# EAGLE design PIC-Sensor-101 (EAGLE 5.01)
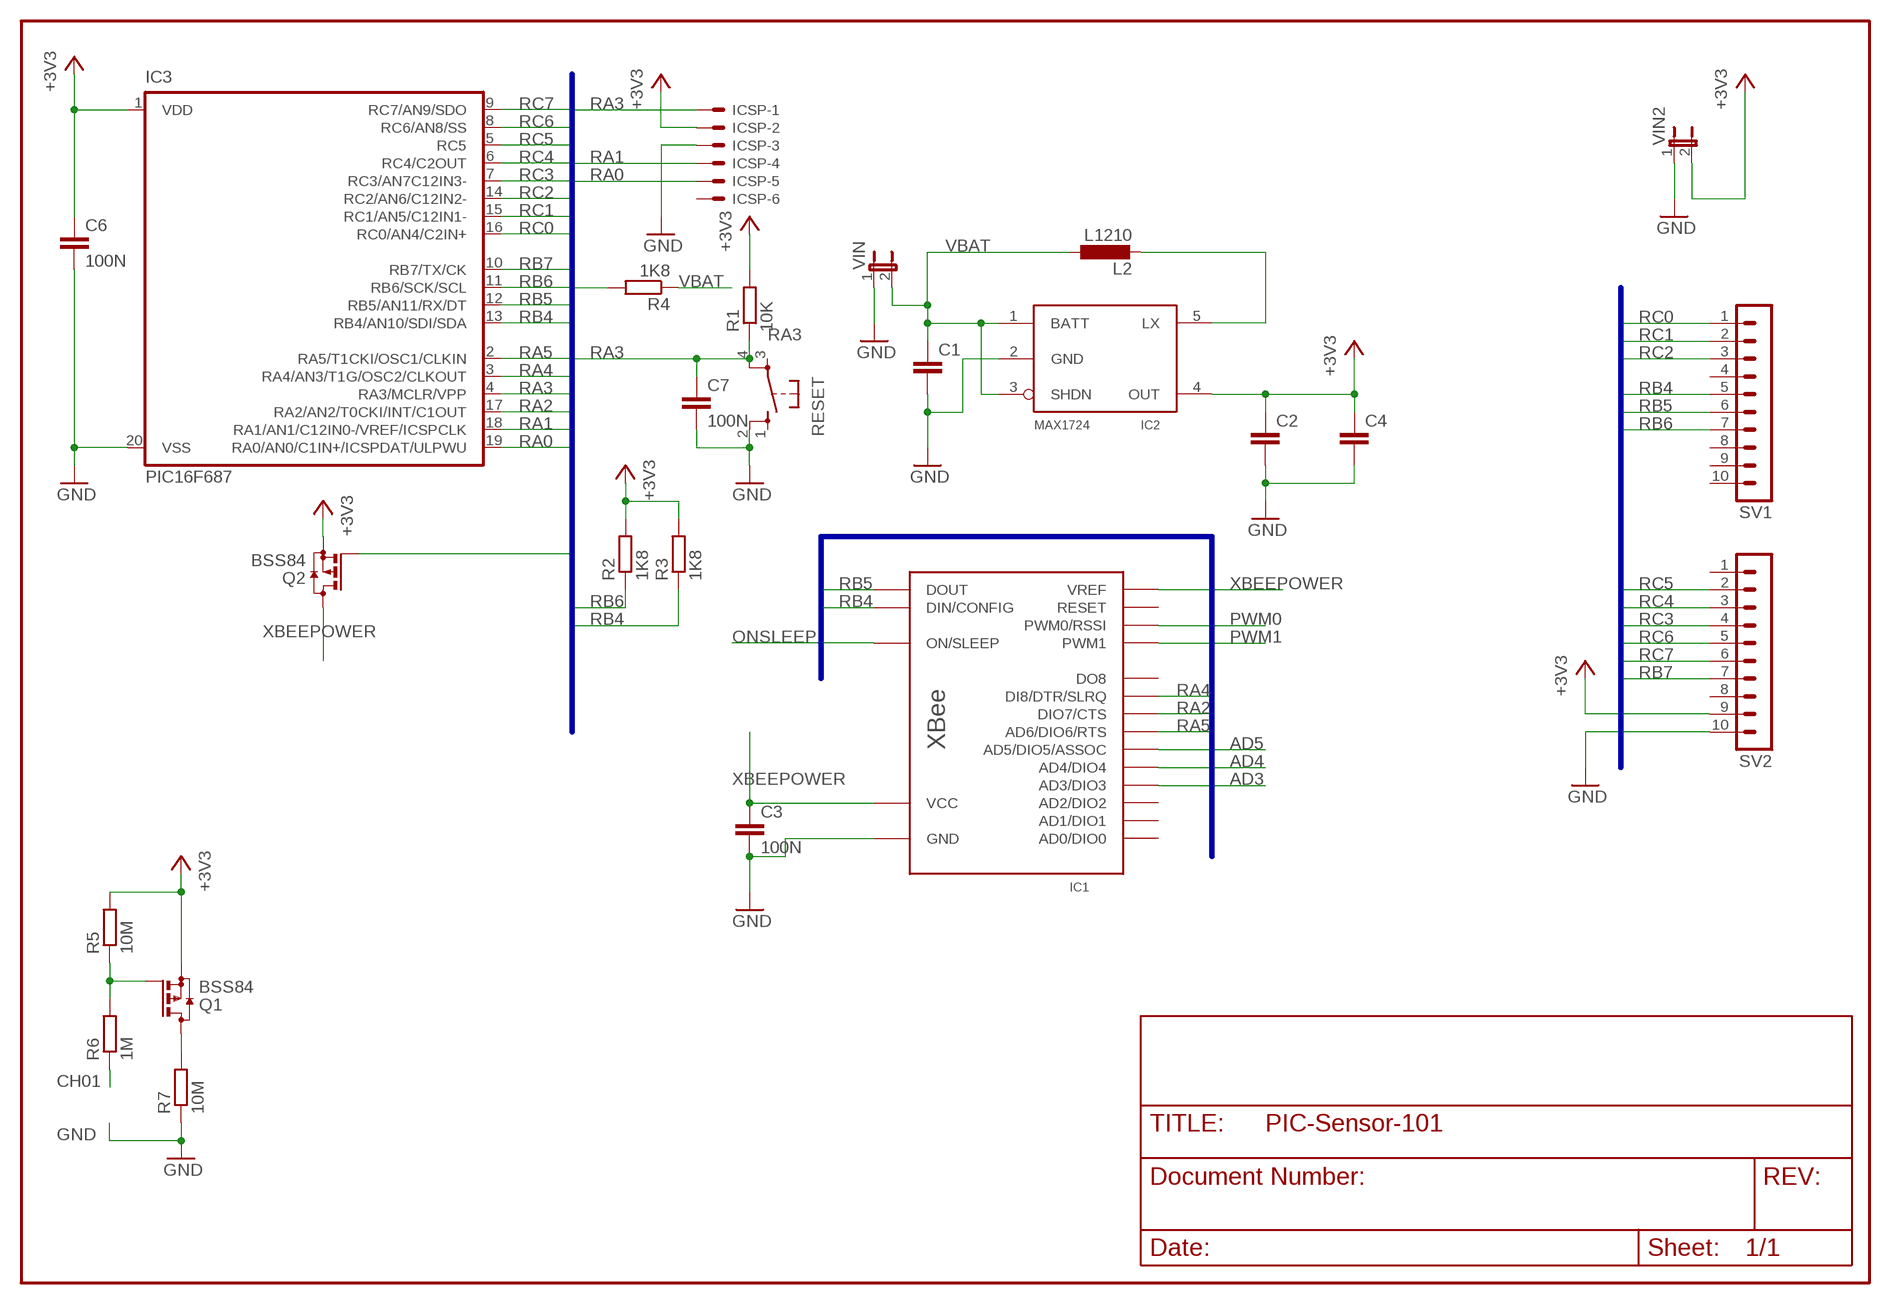
[diagram p0: schematic, sheet 1]

## Parts
C1  C-EUC0805  [C0805]
C2  C-EUC0805  [C0805]
C3  100N  C-EUC0805  [C0805]
C4  C-EUC0805  [C0805]
C6  100N  C-EUC0805  [C0805]
C7  100N  C-EUC0805  [C0805]
IC1  XBEE  [XBEE]
IC2  MAX1724  [SOT23-5L]
IC3  PIC16F687  [SSOP20]
ICSP  53047-06  [53047-06]
L2  L1210  [C1210]
Q1  BSS84  [SOT23]
Q2  BSS84  [SOT23]
R1  10K  R-EU_M0805  [M0805]
R2  1K8  R-EU_M0805  [M0805]
R3  1K8  R-EU_M0805  [M0805]
R4  1K8  R-EU_M0805  [M0805]
R5  10M  R-EU_M0805  [M0805]
R6  1M  R-EU_M0805  [M0805]
R7  10M  R-EU_M0805  [M0805]
RESET  10XX  [B3F-10XX]
SV1  MA10-1  [MA10-1]
SV2  MA10-1  [MA10-1]
VIN  JP1E  [JP1]
VIN2  JP1E  [JP1]

## Nets
+3V3: C2.1 C4.1 C6.1 IC2.4(OUT) IC3.1(VDD) ICSP.2 Q1.2(S) Q2.2(S) R1.2 R2.2 R3.2 R5.2 SV2.9 VIN2.2
AD3: IC1.17(AD3/DIO3)
AD4: IC1.11(AD4/DIO4)
AD5: IC1.15(AD5/DIO5/ASSOC)
CH01: R6.1
GND: C1.2 C2.2 C3.2 C4.2 C6.2 C7.2 IC1.10(GND) IC2.2(GND) IC3.20(VSS) ICSP.3 R7.1 RESET.2 SV2.10 VIN2.1 VIN.1
N$1: Q1.1(G) R5.1 R6.2
N$2: IC2.5(LX) L2.2
N$3: Q1.3(D) R7.2
ONSLEEP: IC1.13(ON/SLEEP)
PWM0: IC1.6(PWM0/RSSI)
PWM1: IC1.7(PWM1)
RA0: IC3.19(RA0/AN0/C1IN+/ICSPDAT/ULPWU) ICSP.5
RA1: IC3.18(RA1/AN1/C12IN0-/VREF/ICSPCLK) ICSP.4
RA2: IC1.12(DIO7/CTS) IC3.17(RA2/AN2/T0CKI/INT/C1OUT)
RA3: C7.1 IC3.4(RA3/MCLR/VPP) ICSP.1 R1.1 RESET.4
RA4: IC1.9(DI8/DTR/SLRQ) IC3.3(RA4/AN3/T1G/OSC2/CLKOUT)
RA5: IC1.16(AD6/DIO6/RTS) IC3.2(RA5/T1CKI/OSC1/CLKIN)
RB4: IC1.3(DIN/CONFIG) IC3.13(RB4/AN10/SDI/SDA) R3.1 SV1.5
RB5: IC1.2(DOUT) IC3.12(RB5/AN11/RX/DT) SV1.6
RB6: IC3.11(RB6/SCK/SCL) R2.1 SV1.7
RB7: IC3.10(RB7/TX/CK) SV2.7
RC0: IC3.16(RC0/AN4/C2IN+) SV1.1
RC1: IC3.15(RC1/AN5/C12IN1-) SV1.2
RC2: IC3.14(RC2/AN6/C12IN2-) SV1.3
RC3: IC3.7(RC3/AN7C12IN3-) SV2.4
RC4: IC3.6(RC4/C2OUT) SV2.3
RC5: IC3.5(RC5) Q2.1(G) SV2.2
RC6: IC3.8(RC6/AN8/SS) SV2.5
RC7: IC3.9(RC7/AN9/SDO) R4.2 SV2.6
VBAT: C1.1 IC2.1(BATT) IC2.3(SHDN) L2.1 R4.1 VIN.2
XBEEPOWER: C3.1 IC1.1(VCC) IC1.14(VREF) Q2.3(D)
Unconnected: IC1.4(DO8) IC1.5(RESET) IC1.18(AD2/DIO2) IC1.19(AD1/DIO1) IC1.20(AD0/DIO0) ICSP.6 RESET.1 RESET.3 SV1.4 SV1.8 SV1.9 SV1.10 SV2.1 SV2.8

## Buses
RA[0..5],RB[4..7],RC[0..7]

## Library data of the parts
C1-C4 C6 C7 = turbod3:C-EU: CAPACITOR, European symbol
IC1 = turbod3:XBEE
IC2 = turbod3:MAX1724
IC3 = microchip-5:PIC16F687*: MICROCONTROLLER PIC16F687 18 I/O One 16-bit timer One 8-bit timer Two comparators Precision internal oscillator-software selectable 8 MHz - 32 KHz SSP w/ I2C Compatible Address mask option EUSART LIN 2.0 Compatible 12 A/D Channels ULPW Enhanced Low Power Timer 1 Timer 1 Gate Synch Latch 2k Program Flash memory 128 bytes SRAM 256 bytes EEPROM
ICSP = con-molex:53?-06: CONNECTOR wire to board 1.25 mm (.049 inch) pitch header
L2 = turbod3:L
Q1 Q2 = transistor-small-signal:BSS84: P-CHANNEL MOS FET
R1-R7 = turbod3:R-EU_: RESISTOR, European symbol
RESET = KEY_B:10XX
SV1 SV2 = con-lstb:MA10-1: PIN HEADER
VIN VIN2 = jumper:JP1E: JUMPER

## Net classes
0 default: width 0.305 mm

## Board
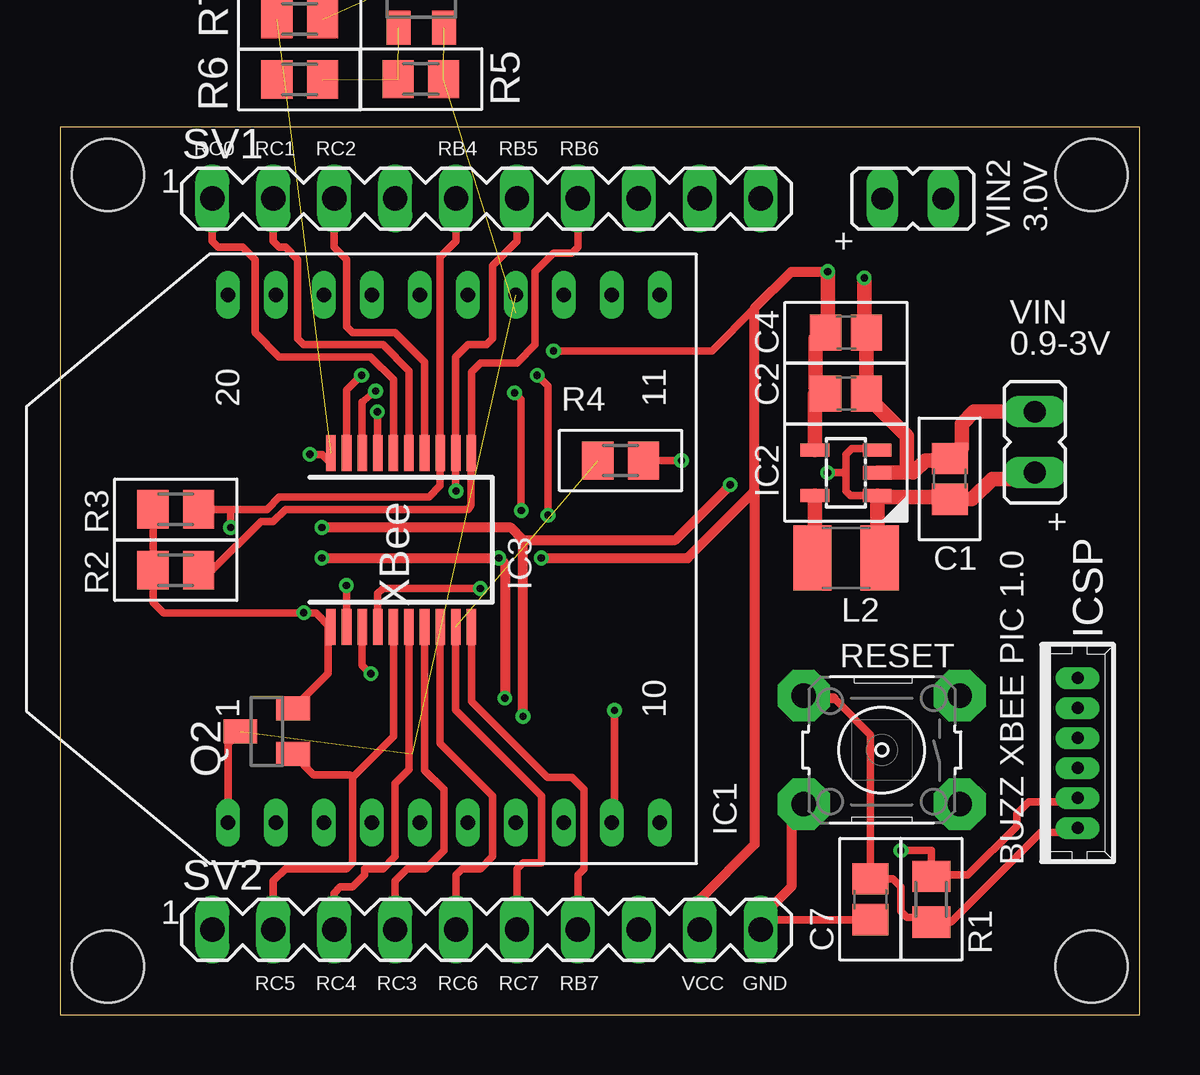
[diagram p1: board, top side]
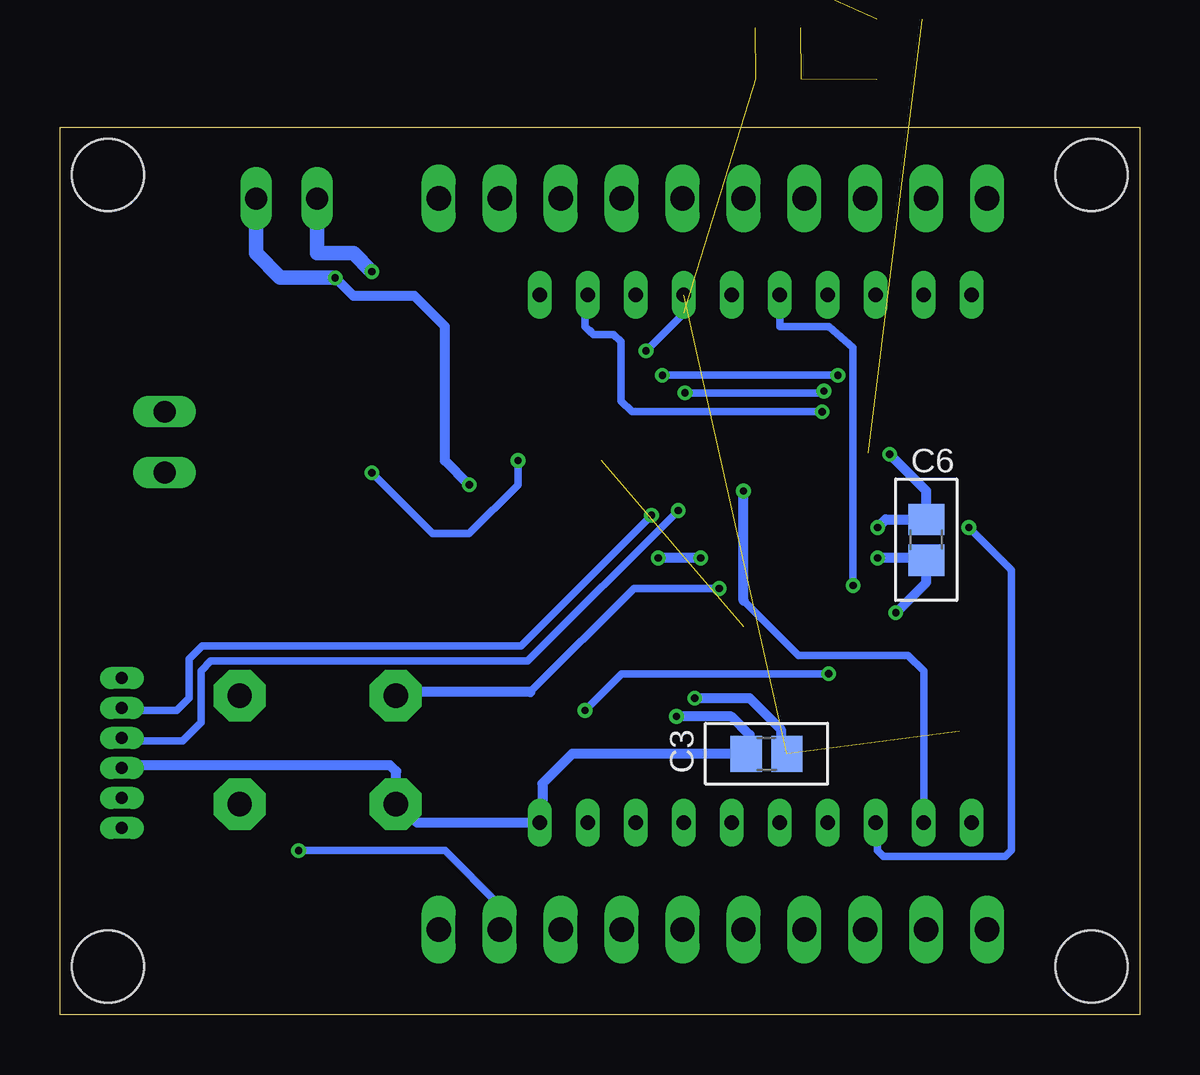
[diagram p2: board, bottom side, seen from below]

Size 45 x 37 mm. Coordinates in mm from the lower left corner, seen from the top.
Outline: 0,0 45,0 45,37 0,37 0,0
Copper layers (1*16): Top 0.035mm / dielectric 1.5mm / Bottom 0.035mm
Design rules "PCB-POOL": minimum track width 6mil, minimum drill 12mil, track to track 6mil, track to pad 6mil, pad to pad 6mil, via to via 6mil, smd to smd 6mil, copper to edge 20mil, drill to drill 8mil, minimum pad ring 8mil, minimum via ring 6mil, stop-mask expansion 3mil, vias tented up to drill 0mil, thermal gap 8mil
Holes 3 mm at 2,35 2,2 43,35 43,2

### Footprints (pad centres in the part's own frame; a part is rotated, then mirrored left to right if it is on the bottom)
C0805 = smd 1.3 x 1.5: 1 -0.85,0; 2 0.85,0
XBEE = drill 0.6 long: 1 -11,17; 2 -11,15; 3 -11,13; 4 -11,11; 5 -11,9; 6 -11,7; 7 -11,5; 8 -11,3; 9 -11,1; 10 -11,-1; 11 11,-1; 12 11,1; 13 11,3; 14 11,5; 15 11,7; 16 11,9; 17 11,11; 18 11,13; 19 11,15; 20 11,17
SOT23-5L = smd 0.55 x 1.2: 1 -0.95,-1.3; 2 0,-1.3; 3 0.95,-1.3; 4 0.95,1.3; 5 -0.95,1.3
SSOP20 = smd 0.4 x 1.5: 1 -2.925,-3.625; 2 -2.275,-3.625; 3 -1.625,-3.625; 4 -0.975,-3.625; 5 -0.325,-3.625; 6 0.325,-3.625; 7 0.975,-3.625; 8 1.625,-3.625; 9 2.275,-3.625; 10 2.925,-3.625; 11 2.925,3.625; 12 2.275,3.625; 13 1.625,3.625; 14 0.975,3.625; 15 0.325,3.625; 16 -0.325,3.625; 17 -0.975,3.625; 18 -1.625,3.625; 19 -2.275,3.625; 20 -2.925,3.625
53047-06 = drill 0.5 pad 0.698 long: 1 3.125,0; 2 1.875,0; 3 0.625,0; 4 -0.625,0; 5 -1.875,0; 6 -3.125,0
C1210 = smd 1.6 x 2.7: 1 -1.4,0; 2 1.4,0
SOT23 = smd 1 x 1.4: 1 -0.95,-1.1; 2 0.95,-1.1; 3 0,1.1
M0805 = smd 1.3 x 1.6: 1 -0.95,0; 2 0.95,0
B3F-10XX = drill 1.016 pad 2.159 octagon: 1 -3.379,2.312; 2 3.123,2.312; 3 -3.379,-2.209; 4 3.123,-2.209
MA10-1 = drill 1.016 long: 1 -11.43,0; 2 -8.89,0; 3 -6.35,0; 4 -3.81,0; 5 -1.27,0; 6 1.27,0; 7 3.81,0; 8 6.35,0; 9 8.89,0; 10 11.43,0
JP1 = drill 0.914 long: 1 0,-1.27; 2 0,1.27

### Placement (x,y rotation side)
C1  37.08,22.34 90 top
C2  32.77,25.89 0 top
C3  15.54,10.87 180 bottom
C4  32.77,28.43 0 top
C6  8.89,19.8 90 bottom
C7  33.78,4.81 270 top
IC1  24,19 90 top
IC2  32.77,22.59 90 top
IC3  14.22,19.8 0 top
ICSP  42.42,10.91 270 top
L2  32.77,19.03 180 top
Q1  15.06,42.24 0 top  (outside the outline)
Q2  8.62,11.81 90 top
R1  36.32,4.81 90 top
R2  4.83,18.53 180 top
R3  4.83,21.07 180 top
R4  23.37,23.1 180 top
R5  15.04,39 0 top
R6  9.99,38.98 0 top
R7  9.99,41.5 0 top  (outside the outline)
RESET  34.13,11.08 180 top
SV1  17.78,34.02 0 top
SV2  17.78,3.54 0 top
VIN  40.64,23.86 180 top
VIN2  35.56,34.02 90 top

### Tracks (layer width: path | path; a pad name or v marks a point on that pad's centre or on a via)
+3V3  (via drill 0.3)  (2 unrouted)
  Top 0.305: 3.88,18.34 R2.2 | 3.88,18.34 R3.2 | 3.88,18.34 3.81,18.27 | 3.88,18.34 3.88,17.19 4.32,16.75 v10.16,16.75 10.67,16.75 11.24,16.17 IC3.1 11.21,16.26 11.18,16.26 11.18,14.22 Q2.2 | ICSP.2 42.42,9.13 42.16,8.87 40.39,8.87 39.88,8.37 39.88,7.86 37.85,5.83 36.07,5.83 36.13,5.76 R1.2 36.32,6.84 v35.05,6.84 | v20.57,27.67 27.18,27.67 28.96,29.45
  Top 0.406: C2.1 31.92,25.81 31.47,25.35 | C2.1 31.5,25.89 31.47,25.86 | C2.1 31.75,25.89 31.5,26.15 | C4.1 31.75,28.43 31.5,28.18 | v32,30.97 30.48,30.97 28.96,29.45 28.96,21.83 | 28.96,21.83 28.96,7.1 26.67,4.81 SV2.9 | v18.54,13.19 18.54,18.78 v18.29,19.03 v10.92,19.03 | v20.07,19.03 26.16,19.03 28.96,21.83
  Top 0.61: 31.47,25.86 IC2.4 | 31.5,28.18 31.5,26.15 | C4.1 31.92,28.6 32,28.69 v32,30.97
  Bottom 0.305: 14.73,10.94 14.73,10.91 14.7,10.87 | v20.57,27.67 19,29.24 | v35.05,6.84 28.96,6.84 26.67,4.56
  Bottom 0.406: 14.73,10.94 14.95,10.94 14.95,11.88 16.26,13.19 v18.54,13.19 | 8.89,18.78 8.89,18.02 v10.16,16.75 | 8.89,18.78 C6.1 | v10.92,19.03 9.14,19.03 8.89,18.78 | v18.29,19.03 v20.07,19.03 | SV2.9 26.67,4.56
  Bottom 0.61: v32,30.97 32.77,31.73 34.29,31.73 VIN2.2 34.04,34.27
GND  (via drill 0.3)  (1 unrouted)
  Top 0.305: IC3.20 11.3,23.22 11.18,23.1 10.92,23.35 v10.41,23.35 | 29.21,4.05 29.21,3.79 | 29.21,3.79 SV2.10 | C7.2 29.38,3.96 29.21,3.79
  Top 0.406: IC2.2 34.04,22.59 | 33.62,25.54 C2.2 33.58,25.84 33.53,25.89 | C1.2 37.08,23.1 37.59,23.61 | 35.31,22.59 35.56,22.59 | 33.53,28.43 33.62,28.34 | v10.92,20.3 18.8,20.3 19.3,19.8 | v19.3,12.43 19.3,19.8 | 19.3,19.8 25.65,19.8 v27.94,22.08 | RESET.2 31.01,8.86 30.99,8.87 30.48,8.37 30.48,5.32 29.21,4.05
  Top 0.61: 37.08,23.1 36.07,23.1 35.56,22.59 | IC2.2 35.31,22.59 35.31,24.11 33.58,25.84 | 33.62,28.34 C2.2 | C4.2 33.53,28.43 v33.53,30.72 | 37.59,23.61 37.59,24.62 38.1,25.13 VIN.1 40.89,24.88
  Bottom 0.406: v33.53,30.72 32.77,29.96 30.23,29.96 28.96,28.69 28.96,23.1 v27.94,22.08 | ICSP.3 42.42,10.14 42.16,10.4 31.24,10.4 30.99,10.14 30.99,8.87 | v10.41,23.35 8.89,21.83 C6.2 10.58,20.65 v10.92,20.3 | v19.3,12.43 17.02,12.43 16.26,11.67 16.26,11.16 16.51,10.91 16.48,10.87 C3.2 23.66,10.87 24.89,9.64 24.89,7.86 25,7.97 IC1.10 30.11,8 30.99,8.87 | 30.99,8.87 31.01,8.86 RESET.2
  Bottom 0.61: v33.53,30.72 35.81,30.72 36.83,31.73 VIN2.1 36.83,34.27
N$1  (2 unrouted)
N$2
  Top 0.406: L2.2 31.37,18.65 31.5,18.78 31.47,18.81
  Top 0.61: 31.47,18.81 IC2.5
N$3  (1 unrouted)
RA0  (via drill 0.3)
  Top 0.305: IC3.19 11.95,26.03 v12.57,26.65 | v20.34,20.81 20.34,26.2 v19.89,26.65
  Bottom 0.305: ICSP.5 42.58,12.78 42.67,12.68 40.13,12.68 39.62,13.19 39.62,14.82 39.06,15.38 25.78,15.38 v20.34,20.81 | v12.57,26.65 12.57,26.76 12.68,26.65 v19.89,26.65
RA1  (via drill 0.3)
  Top 0.305: IC3.18 12.6,25.54 v13.16,25.99 | v19.23,21.02 19.23,25.64 v18.95,25.92
  Bottom 0.305: 42.53,11.53 42.67,11.67 | 42.53,11.53 ICSP.4 | 42.53,11.53 42.42,11.41 39.88,11.41 39.12,12.18 39.12,14.34 38.71,14.74 25.5,14.74 v19.23,21.02 | v13.16,25.99 13.16,26.02 13.18,26.04 13.31,25.92 v18.95,25.92
RA2  (via drill 0.3)
  Top 0.305: IC3.17 13.25,25.09 v13.23,25.13
  Bottom 0.305: 22.92,28.5 23.11,28.69 23.11,30.08 23.03,30 IC1.12 | 22.92,28.5 22.86,28.43 | v13.23,25.13 21.16,25.13 21.61,25.59 21.61,28.05 21.92,28.36 22.76,28.36 22.91,28.51 22.92,28.5
RA3  (via drill 0.3)
  Top 0.305: IC3.4 13.25,17.55 13.46,17.76 v17.53,17.76 | ICSP.1 42.42,7.6 40.89,7.6 37.15,3.86 R1.1 36.39,3.86 36.58,4.05 35.31,4.05 35.05,4.3 35.05,5.32 34.71,5.66 C7.1 33.78,5.57 | 32.26,13.19 33.78,11.67 33.78,5.57 | 33.78,5.57 33.53,5.32
  Top 0.406: RESET.4 31.01,13.21 30.99,13.19 32.26,13.19
  Bottom 0.305: v17.53,17.76 21.08,17.76 25.4,13.45
  Bottom 0.406: RESET.4 31.01,13.21 30.99,13.19 30.73,13.45 25.4,13.45
RA4  (via drill 0.3)
  Top 0.305: IC3.3 12.6,14.56 v12.95,14.21 | IC1.9 22.97,8 22.86,8.11 23.11,8.37 v23.11,12.68
  Bottom 0.305: v12.95,14.21 21.59,14.21 v23.11,12.68
RA5  (via drill 0.3)
  Top 0.305: IC3.2 11.95,18.03 v11.94,17.89
  Bottom 0.305: v11.94,17.89 11.94,27.8 12.95,28.69 14.99,28.69 14.99,30.21 15,30.2 IC1.16
RB4  (via drill 0.3)
  Top 0.305: 8.64,21.07 R3.1 | 8.64,21.07 9.14,21.57 15.39,21.57 15.85,22.06 15.85,23.33 15.82,23.42 IC3.13 15.85,31.58 16.51,32.24 SV1.5 | 8.64,21.07 7.11,21.07 v7.11,20.3
  Bottom 0.305: v7.11,20.3 5.33,18.53 5.33,6.84 5.59,6.59 10.67,6.59 10.92,6.84 10.92,8.08 | 10.92,8.08 10.92,8.11 | 10.92,8.08 IC1.3
RB5  (via drill 0.3)
  Top 0.305: v16.51,21.83 16.5,21.84 IC3.12 16.5,27.41 17.02,27.92 17.78,27.92 18.03,28.18 18.03,31.23 19.05,32.24 SV1.6
  Bottom 0.305: 16.51,17.26 14.22,14.97 9.65,14.97 9,14.32 IC1.2
  Bottom 0.406: 16.51,17.26 v16.51,21.83
RB6
  Top 0.305: R2.1 6.35,18.53 8.38,20.56 8.89,20.56 9.4,21.07 17.02,21.07 17.14,21.24 17.14,23.38 17.2,23.42 IC3.11 17.15,26.79 17.53,27.16 19.05,27.16 19.81,27.92 19.81,30.97 20.57,31.73 21.34,31.73 21.59,31.99 21.59,33.77 21.34,34.02 SV1.7
RB7
  Top 0.305: IC3.10 17.15,13.06 20.32,9.89 21.34,9.89 21.84,9.38 21.84,6.08 21.59,5.83 SV2.7
RC0
  Top 0.305: IC3.16 13.9,26.47 12.95,27.42 9.14,27.42 8.13,28.43 8.13,31.48 7.62,31.99 6.6,31.99 6.35,32.24 SV1.1
RC1
  Top 0.305: IC3.15 14.55,26.84 13.46,27.92 10.16,27.92 9.91,28.18 9.91,31.48 9.4,31.99 9.14,31.99 8.89,32.24 8.89,33.77 9.14,34.02 SV1.2
RC2
  Top 0.305: IC3.14 15.2,27.2 13.97,28.43 12.19,28.43 11.94,28.69 11.94,31.48 11.43,31.99 SV1.3
RC3
  Top 0.305: IC3.7 15.2,10.19 16,9.38 16,6.84 15.24,6.08 14.48,6.08 13.97,5.57 SV2.4 13.97,3.29
RC4
  Top 0.305: IC3.6 14.55,10.21 13.97,9.64 13.97,6.59 13.46,6.08 12.7,6.08 12.7,5.83 12.19,5.32 11.68,5.32 11.43,5.06 SV2.3
RC5
  Top 0.305: IC3.5 13.9,11.6 12.19,9.89 | 12.19,9.89 12.19,6.33 11.94,6.08 9.4,6.08 8.89,5.57 SV2.2 8.89,3.29 | 12.19,9.89 12.08,10 10.58,10 Q2.1
RC6
  Top 0.305: IC3.8 15.85,11.31 18.03,9.13 18.03,6.59 17.53,6.08 16.76,6.08 16.51,5.83 SV2.5
RC7  (1 unrouted)
  Top 0.305: IC3.9 16.5,12.7 20.07,9.13 20.07,6.33 19.3,6.33 19.05,6.08 19.05,3.79 18.8,3.54 SV2.6
VBAT  (via drill 0.3)
  Top 0.305: IC2.1 32.95,21.64 32.77,21.83 32.77,22.59 | 32.77,22.59 32.77,23.35 33.02,23.61 34.29,23.61 | R4.1 v25.91,23.1 | v32,22.59 32.77,22.59
  Top 0.406: 34.12,21.49 34.04,21.57 34.07,21.6 IC2.1 | L2.1 34.17,18.65 34.04,18.78 34.07,18.81 | 34.29,23.61 34.22,23.54 IC2.3 | C1.1 37.08,21.32 36.92,21.49 36.66,21.49 36.58,21.57
  Top 0.61: IC2.1 34.07,18.81 | 34.04,21.57 36.58,21.57 | C1.1 38.01,21.49 38.86,22.34 40.64,22.34 40.89,22.59 VIN.2
  Bottom 0.305: v25.91,23.1 25.91,22.08 27.94,20.05 29.46,20.05 v32,22.59
XBEEPOWER  (2 unrouted)
  Top 0.305: Q2.3 7,11.29 IC1.1

### Text on the board
tNames: RC0 | RC1 | RC2 | RB4 | RB5 | RB6 | 3.0V | + | 0.9-3V | + | BUZZ XBEE PIC 1.0 | RC5 | RC4 | RC3 | RC6 | RC7 | RB7 | VCC | GND